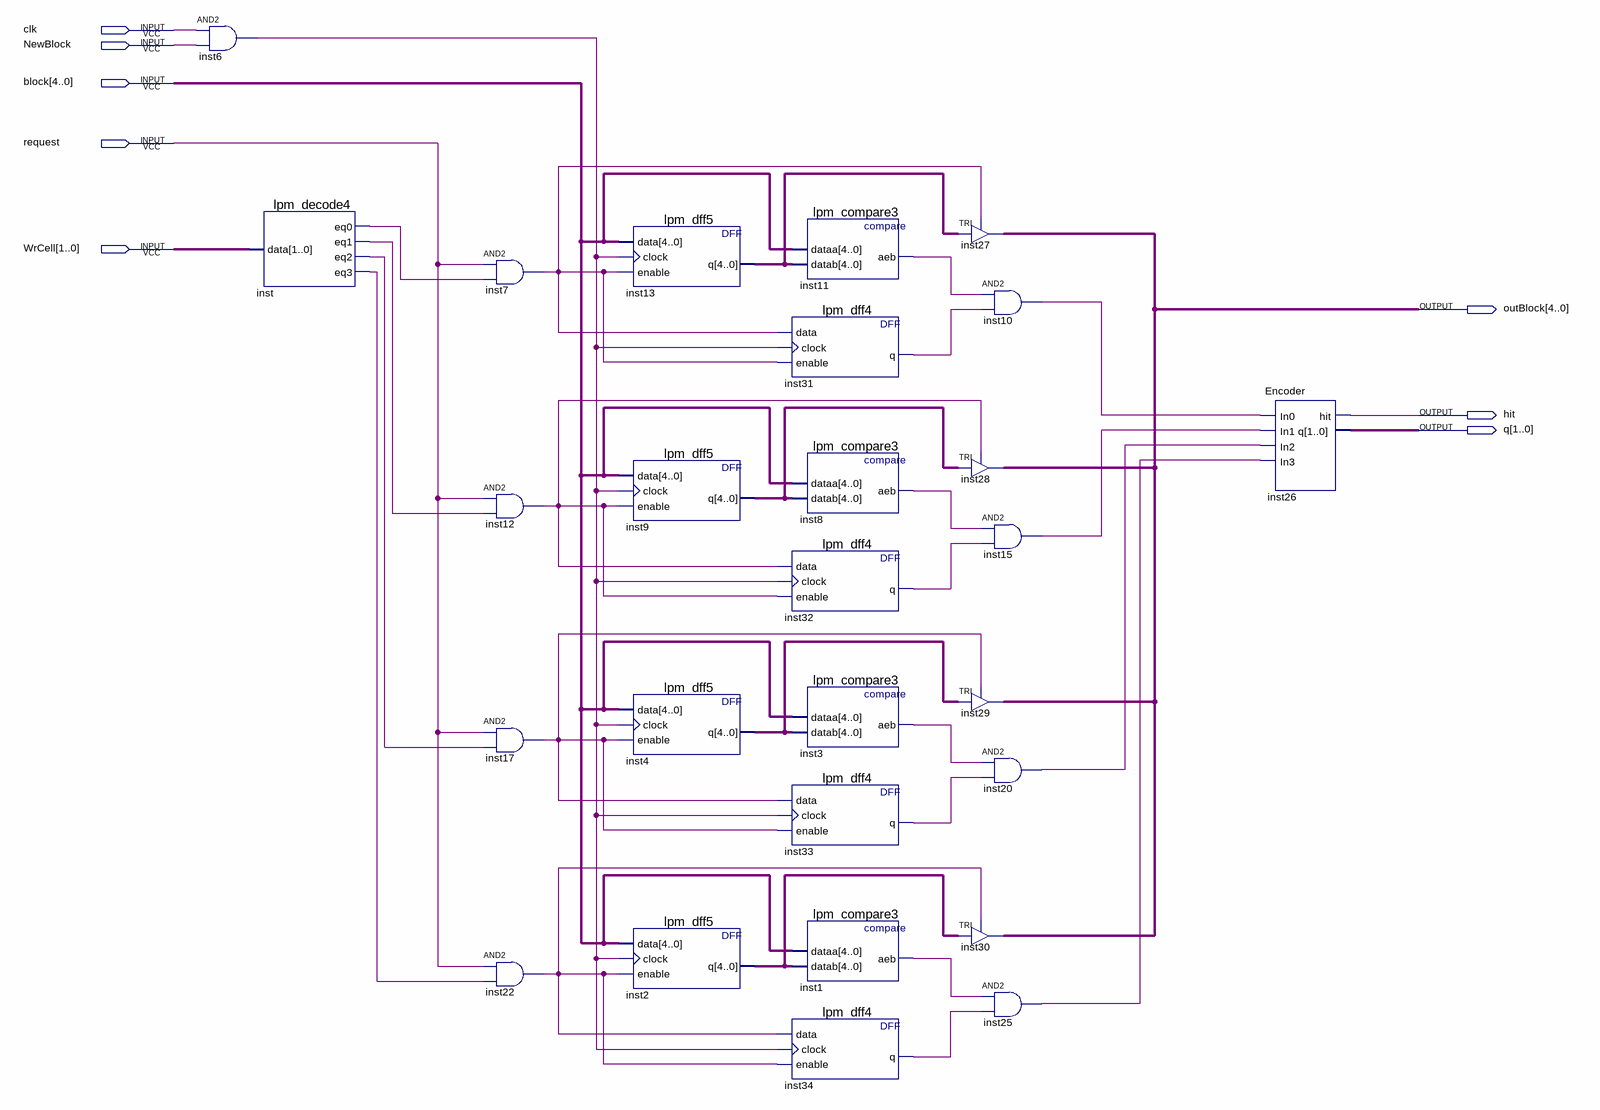
[diagram p0: schematic sheet]
// Quartus schematic string.bdf as structural Verilog: 27 symbols, 8 pins
module \string  (
  input  clk,
  input  NewBlock,
  input  [4:0] block,
  input  request,
  input  [1:0] WrCell,
  output [4:0] outBlock,
  output hit,
  output [1:0] q
);

  wire inst1_aeb, inst3_aeb, inst6_out, inst7_out, inst8_aeb, inst10_out, inst11_aeb, inst12_out, inst15_out,
       inst17_out, inst20_out, inst22_out, inst25_out, inst31_q, inst32_q, inst33_q, inst34_q, inst_eq0,
       inst_eq1, inst_eq2, inst_eq3;
  wire [4:0] inst2_q, inst4_q, inst9_q, inst13_q;

  and inst6 (inst6_out, clk, NewBlock);
  lpm_decode4 inst (.data(WrCell), .eq0(inst_eq0), .eq1(inst_eq1), .eq2(inst_eq2), .eq3(inst_eq3));
  and inst7 (inst7_out, request, inst_eq0);
  and inst12 (inst12_out, request, inst_eq1);
  and inst17 (inst17_out, request, inst_eq2);
  and inst22 (inst22_out, request, inst_eq3);
  lpm_dff5 inst13 (.data(block), .clock(inst6_out), .enable(inst7_out), .q(inst13_q));
  lpm_dff5 inst9 (.data(block), .clock(inst6_out), .enable(inst12_out), .q(inst9_q));
  lpm_dff5 inst4 (.data(block), .clock(inst6_out), .enable(inst17_out), .q(inst4_q));
  lpm_dff5 inst2 (.data(block), .clock(inst6_out), .enable(inst22_out), .q(inst2_q));
  lpm_compare3 inst11 (.dataa(block), .datab(inst13_q), .aeb(inst11_aeb));
  lpm_dff4 inst31 (.data(inst7_out), .clock(inst6_out), .enable(inst7_out), .q(inst31_q));
  lpm_compare3 inst8 (.dataa(block), .datab(inst9_q), .aeb(inst8_aeb));
  lpm_dff4 inst32 (.data(inst12_out), .clock(inst6_out), .enable(inst12_out), .q(inst32_q));
  lpm_compare3 inst3 (.dataa(block), .datab(inst4_q), .aeb(inst3_aeb));
  lpm_dff4 inst33 (.data(inst17_out), .clock(inst6_out), .enable(inst17_out), .q(inst33_q));
  lpm_compare3 inst1 (.dataa(block), .datab(inst2_q), .aeb(inst1_aeb));
  lpm_dff4 inst34 (.data(inst22_out), .clock(inst6_out), .enable(inst22_out), .q(inst34_q));
  TRI inst27[4:0] (.IN(inst13_q), .OE(inst7_out), .OUT(outBlock));
  and inst10 (inst10_out, inst11_aeb, inst31_q);
  TRI inst28[4:0] (.IN(inst9_q), .OE(inst12_out), .OUT(outBlock));
  and inst15 (inst15_out, inst8_aeb, inst32_q);
  TRI inst29[4:0] (.IN(inst4_q), .OE(inst17_out), .OUT(outBlock));
  and inst20 (inst20_out, inst3_aeb, inst33_q);
  TRI inst30[4:0] (.IN(inst2_q), .OE(inst22_out), .OUT(outBlock));
  and inst25 (inst25_out, inst1_aeb, inst34_q);
  Encoder inst26 (.In0(inst10_out), .In1(inst15_out), .In2(inst20_out), .In3(inst25_out), .hit(hit), .q(q));
endmodule
